# Altium schematic sheet Sheet2.SchDoc
size A4
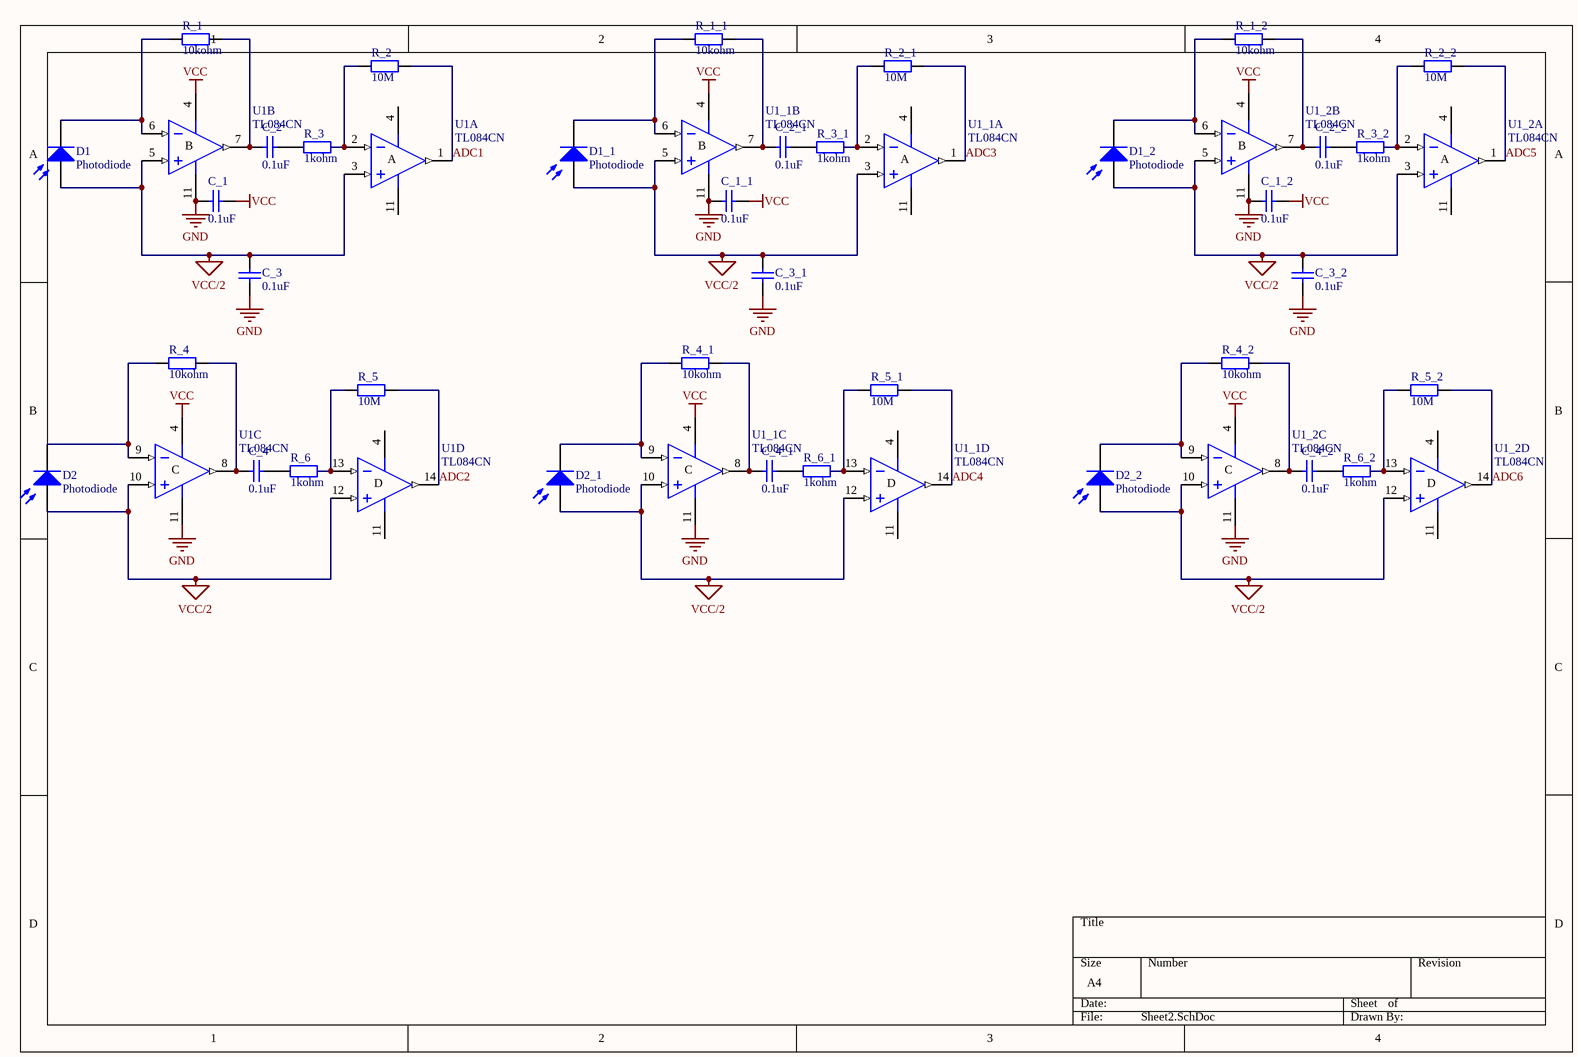
[diagram p0: Sheet2.SchDoc]

## Parts
C_1  0.1uF  [cms805 - mini]
C_1_1  0.1uF  [cms805 - mini]
C_1_2  0.1uF  [cms805 - mini]
C_2  0.1uF  [cms805 - mini]
C_2_1  0.1uF  [cms805 - mini]
C_2_2  0.1uF  [cms805 - mini]
C_3  0.1uF  [cms805 - mini]
C_3_1  0.1uF  [cms805 - mini]
C_3_2  0.1uF  [cms805 - mini]
C_4  0.1uF  [cms805 - mini]
C_4_1  0.1uF  [cms805 - mini]
C_4_2  0.1uF  [cms805 - mini]
D1  Photodiode  [TEMD1000]
D1_1  Photodiode  [TEMD1000]
D1_2  Photodiode  [TEMD1000]
D2  Photodiode  [TEMD1000]
D2_1  Photodiode  [TEMD1000]
D2_2  Photodiode  [TEMD1000]
R_1  10kohm  [cms805 - mini]
R_1_1  10kohm  [cms805 - mini]
R_1_2  10kohm  [cms805 - mini]
R_2  10M  [cms805 - mini]
R_2_1  10M  [cms805 - mini]
R_2_2  10M  [cms805 - mini]
R_3  1kohm  [cms805 - mini]
R_3_1  1kohm  [cms805 - mini]
R_3_2  1kohm  [cms805 - mini]
R_4  10kohm  [cms805 - mini]
R_4_1  10kohm  [cms805 - mini]
R_4_2  10kohm  [cms805 - mini]
R_5  10M  [cms805 - mini]
R_5_1  10M  [cms805 - mini]
R_5_2  10M  [cms805 - mini]
R_6  1kohm  [cms805 - mini]
R_6_1  1kohm  [cms805 - mini]
R_6_2  1kohm  [cms805 - mini]
U1  TL084CN  [TSSOP14]  (parts A,B,C,D of 4)
U1_1  TL084CN  [TSSOP14]  (parts A,B,C,D of 4)
U1_2  TL084CN  [TSSOP14]  (parts A,B,C,D of 4)

## Nets
GND: C_1.1 C_1_1.1 C_1_2.1 C_3.1 C_3_1.1 C_3_2.1 U1.11(V-) U1_1.11(V-) U1_2.11(V-)
VCC: C_1.2 C_1_1.2 C_1_2.2 U1.4(V+) U1_1.4(V+) U1_2.4(V+)
VCC/2: C_3.2 C_3_1.2 C_3_2.2 D1.1(A) D1_1.1(A) D1_2.1(A) D2.1(A) D2_1.1(A) D2_2.1(A) U1.3(IN+) U1.5(IN+) U1.10(IN+) U1.12(IN+) U1_1.3(IN+) U1_1.5(IN+) U1_1.10(IN+) U1_1.12(IN+) U1_2.3(IN+) U1_2.5(IN+) U1_2.10(IN+) U1_2.12(IN+)
ADC1: R_2.2 U1.1(OUT)
ADC2: R_5.2 U1.14(OUT)
ADC3: R_2_1.2 U1_1.1(OUT)
ADC4: R_5_1.2 U1_1.14(OUT)
ADC5: R_2_2.2 U1_2.1(OUT)
ADC6: R_5_2.2 U1_2.14(OUT)
NetC_2_1: C_2.1 R_3.1
NetC_2_1_1: C_2_1.1 R_3_1.1
NetC_2_1_2: C_2_1.2 R_1_1.2 U1_1.7(OUT)
NetC_2_2: C_2.2 R_1.2 U1.7(OUT)
NetC_2_2_1: C_2_2.1 R_3_2.1
NetC_2_2_2: C_2_2.2 R_1_2.2 U1_2.7(OUT)
NetC_4_1: C_4.1 R_6.1
NetC_4_1_1: C_4_1.1 R_6_1.1
NetC_4_1_2: C_4_1.2 R_4_1.2 U1_1.8(OUT)
NetC_4_2: C_4.2 R_4.2 U1.8(OUT)
NetC_4_2_1: C_4_2.1 R_6_2.1
NetC_4_2_2: C_4_2.2 R_4_2.2 U1_2.8(OUT)
NetD1_1_2: D1_1.2(K) R_1_1.1 U1_1.6(IN-)
NetD1_2: D1.2(K) R_1.1 U1.6(IN-)
NetD1_2_2: D1_2.2(K) R_1_2.1 U1_2.6(IN-)
NetD2_1_2: D2_1.2(K) R_4_1.1 U1_1.9(IN-)
NetD2_2: D2.2(K) R_4.1 U1.9(IN-)
NetD2_2_2: D2_2.2(K) R_4_2.1 U1_2.9(IN-)
NetR_2_1: R_2.1 R_3.2 U1.2(IN-)
NetR_2_1_1: R_2_1.1 R_3_1.2 U1_1.2(IN-)
NetR_2_2_1: R_2_2.1 R_3_2.2 U1_2.2(IN-)
NetR_5_1: R_5.1 R_6.2 U1.13(IN-)
NetR_5_1_1: R_5_1.1 R_6_1.2 U1_1.13(IN-)
NetR_5_2_1: R_5_2.1 R_6_2.2 U1_2.13(IN-)

## Notes on the sheet
- (in symbol TL084CN, part A) A
- (in symbol TL084CN, part B) B
- (in symbol TL084CN, part C) C
- (in symbol TL084CN, part D) D

## Library data of the parts
C_1 C_1_1 C_1_2 C_2 C_2_1 C_2_2 C_3 C_3_1 C_3_2 C_4 C_4_1 C_4_2 = Capa
R_1 R_1_1 R_1_2 R_2 R_2_1 R_2_2 R_3 R_3_1 R_3_2 R_4 R_4_1 R_4_2 R_5 R_5_1 R_5_2 R_6 R_6_1 R_6_2 = Resistance
U1 U1_1 U1_2 = TL084CN: General-Purpose J-FET Quad Operational Amplifier; Published: 24-Aug-2001; LatestRevisionDate: 06-Jun-2005; LatestRevisionNote: Stylized 3D Model Added.; DatasheetVersion: Jan-1999; PackageVersion: Jan-1997; PackageReference: DIP14; Publisher: Altium Limited; PackageDescription: DIP; 14 Leads; Row Spacing 7.62 mm; Pitch 2.54 mm; ComponentLink1Description: Manufacturer Link; ComponentLink1URL: http://www.st.com/; ComponentLink2Description: Datasheet; ComponentLink2URL: http://www.st.com/stonline/products/literature/ds/2301/tl084.pdf
D1 D1_1 D1_2 D2 D2_1 D2_2 = Photodiode: Published: 24-Mar-1999; LatestRevisionDate: 17-Jul-2002; LatestRevisionNote: Re-released for DXP Platform.; PackageReference: PIN2; Publisher: Altium Limited